# Altium schematic sheet 单片机扩展.SchDoc
size A3
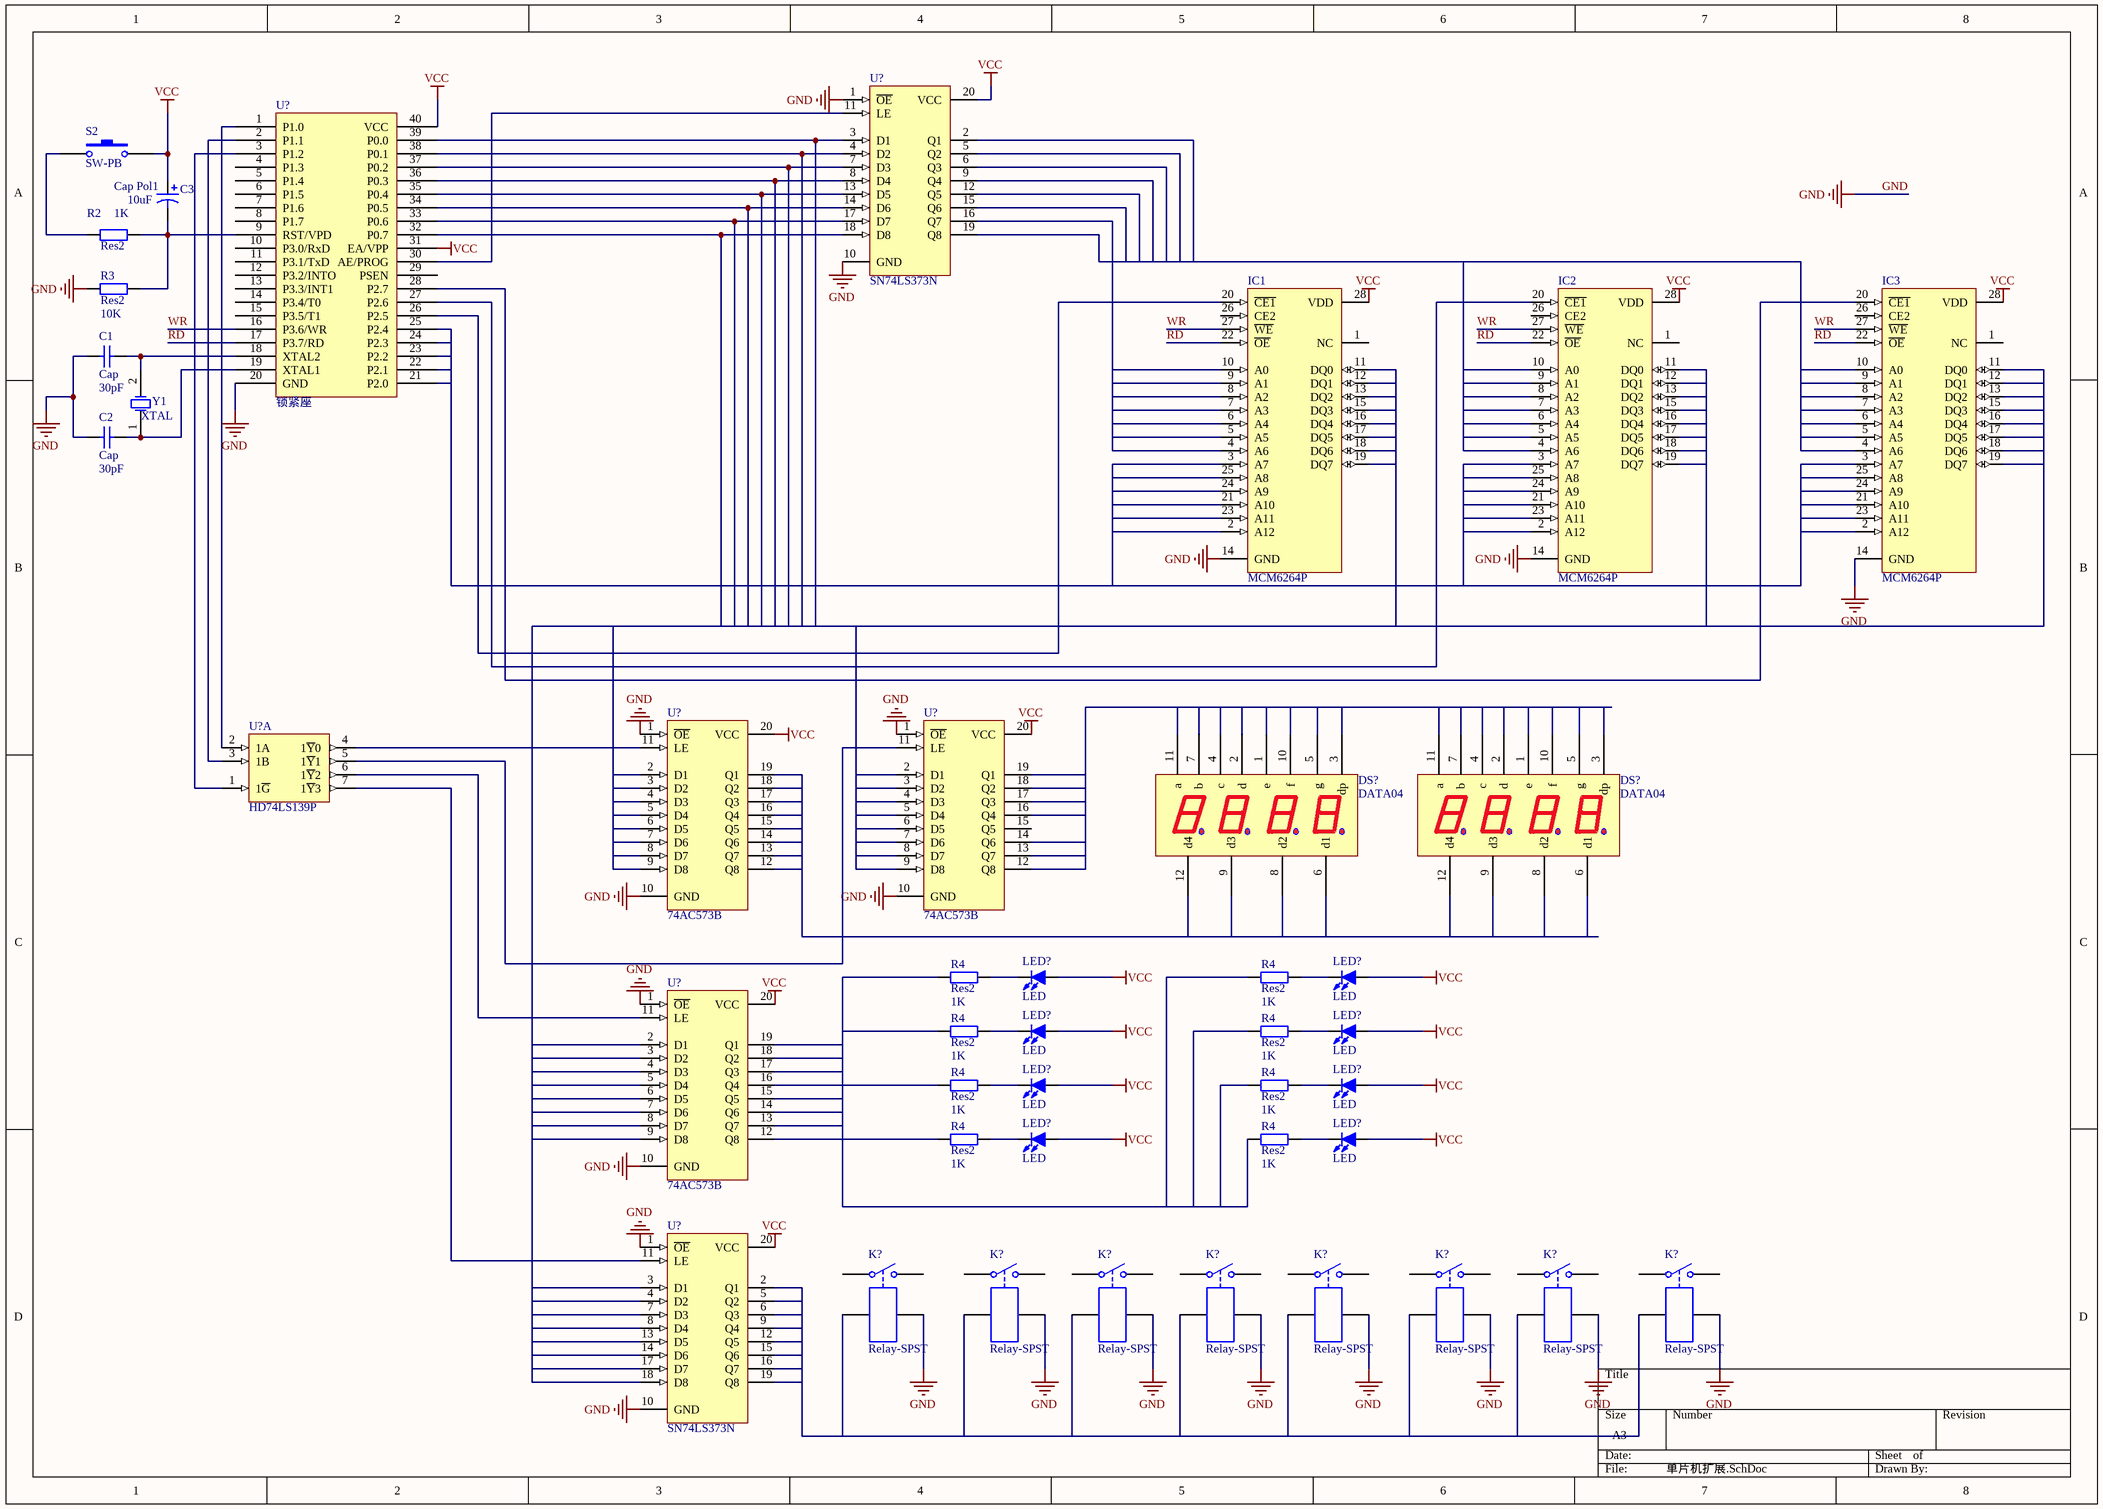
[diagram p0: 单片机扩展.SchDoc]

## Parts
(Parts that share a designator on the sheet are numbered #1, #2 ... from top to bottom, then left to right.)
C1  Cap  value 30pF  [RAD-0.3]
C2  Cap  value 30pF  [RAD-0.3]
C3  Cap Pol1  value 10uF  [RB7.6-15]
DS?#1  DATA04  [DS4]
DS?#2  DATA04  [DS4]
IC1  MCM6264P  [710B-01]
IC2  MCM6264P  [710B-01]
IC3  MCM6264P  [710B-01]
K?#1  Relay-SPST  [MODULE4]
K?#2  Relay-SPST  [MODULE4]
K?#3  Relay-SPST  [MODULE4]
K?#4  Relay-SPST  [MODULE4]
K?#5  Relay-SPST  [MODULE4]
K?#6  Relay-SPST  [MODULE4]
K?#7  Relay-SPST  [MODULE4]
K?#8  Relay-SPST  [MODULE4]
LED?#1  LED  [LED 3MM-R]
LED?#2  LED  [LED 3MM-R]
LED?#3  LED  [LED 3MM-R]
LED?#4  LED  [LED 3MM-R]
LED?#5  LED  [LED 3MM-R]
LED?#6  LED  [LED 3MM-R]
LED?#7  LED  [LED 3MM-R]
LED?#8  LED  [LED 3MM-R]
R2  Res2  value 1K  [AXIAL-0.4]
R3  Res2  value 10K  [AXIAL-0.4]
R4#1  Res2  value 1K  [AXIAL-0.4]
R4#2  Res2  value 1K  [AXIAL-0.4]
R4#3  Res2  value 1K  [AXIAL-0.4]
R4#4  Res2  value 1K  [AXIAL-0.4]
R4#5  Res2  value 1K  [AXIAL-0.4]
R4#6  Res2  value 1K  [AXIAL-0.4]
R4#7  Res2  value 1K  [AXIAL-0.4]
R4#8  Res2  value 1K  [AXIAL-0.4]
S2  SW-PB  [SPST-2]
U?#1  SN74LS373N  [N020]
U?#2  锁紧座  [DIP_TP40-600]
U?#3  74AC573B  [DIP20]
U?#4  74AC573B  [DIP20]
U?#5  HD74LS139P  [PRDP0016AE-B]  (part A of 2)
U?#6  74AC573B  [DIP20]
U?#7  SN74LS373N  [N020]
Y1  XTAL  [R38]

## Nets
GND: C1.1 C2.1 IC1.14(GND) IC2.14(GND) IC3.14(GND) K?#1.4 K?#2.4 K?#3.4 K?#4.4 K?#5.4 K?#6.4 K?#7.4 K?#8.4 R3.2 U?#1.1(~{OE}) U?#1.10(GND) U?#2.20(GND) U?#3.1(~{OE}) U?#3.10(GND) U?#4.1(~{OE}) U?#4.10(GND) U?#6.1(~{OE}) U?#6.10(GND) U?#7.1(~{OE}) U?#7.10(GND)
VCC: C3.1 IC1.28(VDD) IC2.28(VDD) IC3.28(VDD) LED?#1.1(A) LED?#2.1(A) LED?#3.1(A) LED?#4.1(A) LED?#5.1(A) LED?#6.1(A) LED?#7.1(A) LED?#8.1(A) S2.2 U?#1.20(VCC) U?#2.31(EA/VPP) U?#2.40(VCC) U?#3.20(VCC) U?#4.20(VCC) U?#6.20(VCC) U?#7.20(VCC)
RD: IC1.22(~{OE}) IC2.22(~{OE}) IC3.22(~{OE}) U?#2.17(P3.7/RD)
WR: IC1.27(~{WE}) IC2.27(~{WE}) IC3.27(~{WE}) U?#2.16(P3.6/WR)
NetC1_2: C1.2 U?#2.18(XTAL2) Y1.2(OSC2)
NetC2_2: C2.2 U?#2.19(XTAL1) Y1.1(OSC1)
NetC3_2: C3.2 R2.2 R3.1 U?#2.9(RST/VPD)
NetIC1_20: IC1.20(~{CE1}) U?#2.26(P2.5)
NetIC2_20: IC2.20(~{CE1}) U?#2.27(P2.6)
NetIC3_20: IC3.20(~{CE1}) U?#2.28(P2.7)
NetLED?#1_2: LED?#1.2(K) R4#1.2
NetLED?#2_2: LED?#2.2(K) R4#2.2
NetLED?#3_2: LED?#3.2(K) R4#3.2
NetLED?#4_2: LED?#4.2(K) R4#4.2
NetLED?#5_2: LED?#5.2(K) R4#5.2
NetLED?#6_2: LED?#6.2(K) R4#6.2
NetLED?#7_2: LED?#7.2(K) R4#7.2
NetLED?#8_2: LED?#8.2(K) R4#8.2
NetR2_1: R2.1 S2.1
NetR4#5_1: R4#5.1 U?#6.16(Q4)
NetR4#7_1: R4#7.1 U?#6.12(Q8)
NetU?#1_3: U?#1.3(D1) U?#2.39(P0.0)
NetU?#1_4: U?#1.4(D2) U?#2.38(P0.1)
NetU?#1_7: U?#1.7(D3) U?#2.37(P0.2)
NetU?#1_8: U?#1.8(D4) U?#2.36(P0.3)
NetU?#1_11: U?#1.11(LE) U?#2.30(AE/PROG)
NetU?#1_13: U?#1.13(D5) U?#2.35(P0.4)
NetU?#1_14: U?#1.14(D6) U?#2.34(P0.5)
NetU?#1_17: U?#1.17(D7) U?#2.33(P0.6)
NetU?#1_18: U?#1.18(D8) U?#2.32(P0.7)
NetU?#2_1: U?#2.1(P1.0) U?#5.2(1A)
NetU?#2_2: U?#2.2(P1.1) U?#5.3(1B)
NetU?#2_3: U?#2.3(P1.2) U?#5.1(1~{G})
NetU?#3_11: U?#3.11(LE) U?#5.4(1~{Y}0)
NetU?#4_11: U?#4.11(LE) U?#5.5(1~{Y}1)
NetU?#5_6: U?#5.6(1~{Y}2) U?#6.11(LE)
NetU?#5_7: U?#5.7(1~{Y}3) U?#7.11(LE)

Not connected (* = marked no-connect by the designer): DS?#1 1(e) 2(d) 3(dp) 4(c) 5(g) 6(d1) 7(b) 8(d2) 9(d3) 10(f) 11(a) 12(d4); DS?#2 1(e) 2(d) 3(dp) 4(c) 5(g) 6(d1) 7(b) 8(d2) 9(d3) 10(f) 11(a) 12(d4); IC1 1(NC) 2(A12) 3(A7) 4(A6) 5(A5) 6(A4) 7(A3) 8(A2) 9(A1) 10(A0) 11(DQ0) 12(DQ1) 13(DQ2) 15(DQ3) 16(DQ4) 17(DQ5) 18(DQ6) 19(DQ7) 21(A10) 23(A11) 24(A9) 25(A8) 26(CE2); IC2 1(NC) 2(A12) 3(A7) 4(A6) 5(A5) 6(A4) 7(A3) 8(A2) 9(A1) 10(A0) 11(DQ0) 12(DQ1) 13(DQ2) 15(DQ3) 16(DQ4) 17(DQ5) 18(DQ6) 19(DQ7) 21(A10) 23(A11) 24(A9) 25(A8) 26(CE2); IC3 1(NC) 2(A12) 3(A7) 4(A6) 5(A5) 6(A4) 7(A3) 8(A2) 9(A1) 10(A0) 11(DQ0) 12(DQ1) 13(DQ2) 15(DQ3) 16(DQ4) 17(DQ5) 18(DQ6) 19(DQ7) 21(A10) 23(A11) 24(A9) 25(A8) 26(CE2); K?#1 1 2 3; K?#2 1 2 3; K?#3 1 2 3; K?#4 1 2 3; K?#5 1 2 3; K?#6 1 2 3; K?#7 1 2 3; K?#8 1 2 3; R4#1 1; R4#2 1; R4#3 1; R4#4 1; R4#6 1; R4#8 1; U?#1 2(Q1) 5(Q2) 6(Q3) 9(Q4) 12(Q5) 15(Q6) 16(Q7) 19(Q8); U?#2 4(P1.3) 5(P1.4) 6(P1.5) 7(P1.6) 8(P1.7) 10(P3.0/RxD) 11(P3.1/TxD) 12(P3.2/INTO) 13(P3.3/INT1) 14(P3.4/T0) 15(P3.5/T1) 21(P2.0) 22(P2.1) 23(P2.2) 24(P2.3) 25(P2.4) 29(PSEN); U?#3 2(D1) 3(D2) 4(D3) 5(D4) 6(D5) 7(D6) 8(D7) 9(D8) 12(Q8) 13(Q7) 14(Q6) 15(Q5) 16(Q4) 17(Q3) 18(Q2) 19(Q1); U?#4 2(D1) 3(D2) 4(D3) 5(D4) 6(D5) 7(D6) 8(D7) 9(D8) 12(Q8) 13(Q7) 14(Q6) 15(Q5) 16(Q4) 17(Q3) 18(Q2) 19(Q1); U?#5 8(GND) 16(VCC); U?#6 2(D1) 3(D2) 4(D3) 5(D4) 6(D5) 7(D6) 8(D7) 9(D8) 13(Q7) 14(Q6) 15(Q5) 17(Q3) 18(Q2) 19(Q1); U?#7 2(Q1) 3(D1) 4(D2) 5(Q2) 6(Q3) 7(D3) 8(D4) 9(Q4) 12(Q5) 13(D5) 14(D6) 15(Q6) 16(Q7) 17(D7) 18(D8) 19(Q8)

## Library data of the parts
C1 C2 = Cap: Capacitor; Published: 8-Jun-2000; LatestRevisionDate: 17-Jul-2002; LatestRevisionNote: Re-released for DXP Platform.; PackageReference: RAD-0.3; Publisher: Altium Limited; PackageDescription: Radial Cap, Thru-Hole; 2 Leads; 0.3 in Pin Spacing
C3 = Cap Pol1: Polarized Capacitor (Radial); Published: 8-Jun-2000; LatestRevisionDate: 17-Jul-2002; LatestRevisionNote: Re-released for DXP Platform.; PackageReference: RB7.6-15; Publisher: Altium Limited; PackageDescription: Polarized Capacitor (Radial); 2 Leads
DS?#1 DS?#2 = DATA04: DS?
IC1-IC3 = MCM6264P: 8K x 8-Bit Fast Static RAM; Published: 17-Jul-2002; LatestRevisionDate: 06-Jun-2005; LatestRevisionNote: Stylized 3D Model Added.; DatasheetVersion: 1991; PackageReference: 710B-01; Publisher: Altium Limited; PackageDescription: DIP; 28 Leads; Row Spacing 7.62 mm; Pitch 2.54 mm; ComponentLink1Description: Manufacturer Link; ComponentLink1URL: http://www.motorola.com/
K?#1-K?#8 = Relay-SPST: Single-Pole Single-Throw Relay; Published: 24-Mar-1999; LatestRevisionDate: 17-Jul-2002; LatestRevisionNote: Re-released for DXP Platform.; PackageReference: MODULE4; Publisher: Altium Limited
LED?#1-LED?#8 = LED-3MM: 插件LED; 版权归属: 黎明电子style; BOM名称: 插件LED; 学习资源: https://lmdzstyle.taobao.com/
R2 R3 R4#1-R4#8 = Res2: Resistor; Published: 8-Jun-2000; LatestRevisionDate: 17-Jul-2002; LatestRevisionNote: Re-released for DXP Platform.; PackageReference: AXIAL-0.4; Publisher: Altium Limited; PackageDescription: Axial Device, Thru-Hole; 2 Leads; 0.4 in Pin Spacing
S2 = SW-PB: Switch; Published: 24-Mar-1999; LatestRevisionDate: 17-Jul-2002; LatestRevisionNote: Re-released for DXP Platform.; PackageReference: SPST-2; Publisher: Altium Limited; PackageDescription: Switch; 2 Leads
U?#1 U?#7 = SN74LS373N: Octal D-Type Transparent Latche and Edge-Triggered Flip-Flops; Published: 8-Jun-2000; LatestRevisionDate: 04-Mar-2005; LatestRevisionNote: Stylized 3D Model Added.; DatasheetVersion: Mar-1988; PackageVersion: Oct-1995; PackageReference: N020; Publisher: Altium Limited; PackageDescription: DIP; 20 Leads; Row Spacing 7.62 mm; Pitch 2.54 mm; ComponentLink1Description: Manufacturer Link; ComponentLink1URL: http://www.ti.com/; ComponentLink2Description: Datasheet; ComponentLink2URL: http://www-s.ti.com/sc/ds/sn74s373.pdf
U?#2 = STC89C52
U?#3 U?#4 U?#6 = 74AC573B: Octal D-Type Latch with 3-State Output Non-Inverting; Published: 8-Jun-2000; LatestRevisionDate: 06-Jun-2005; LatestRevisionNote: Stylized 3D Model Added.; DatasheetVersion: Apr-1997; PackageVersion: Jun-1998; PackageReference: DIP20; Publisher: Altium Limited; PackageDescription: DIP; 20 Leads; Row Spacing 7.62 mm; Pitch 2.54 mm; Code_JEDEC: MS-015-AE; ComponentLink1Description: Manufacturer Link; ComponentLink1URL: http://www.st.com/; ComponentLink2Description: Datasheet; ComponentLink2URL: http://www.st.com/stonline/products/literature/ds/4702/74ac573.pdf
U?#5 = HD74LS139P: Dual 2-Line-to-4-Line Decoders / Demultiplexers; Published: 10-Feb-2010; DatasheetVersion: Rev.2.00, Feb-2005; PackageVersion: Sep-2005; PackageReference: PRDP0016AE-B; Publisher: Altium Limited; PackageDescription: DIP, Plastic, 16-Pin, Row Spacing 7.62 mm, Pitch 2.54 mm; Code_JEITA: P-DIP16-6.3x19.2-2.54; ComponentLink1Description: Manufacturer Link; ComponentLink1URL: http://sg.renesas.com/fmwk.jsp?cnt=hd74ls_root.jsp&fp=/products/standard_ic/general_purpose_logic/5v_standard_logic/hd74ls/; ComponentLink2Description: Datasheet; ComponentLink2URL: http://documentation.renesas.com/eng/products/logic/rej03d0435_hd74ls139.pdf; ComponentLink3Description: Packaging Specification; ComponentLink3URL: http://sg.renesas.com/media/products/common_info/package/pdf/ic/code/prdp0016ae_b.pdf
Y1 = XTAL: Crystal Oscillator; Published: 8-Jun-2000; LatestRevisionDate: 17-Jul-2002; LatestRevisionNote: Re-released for DXP Platform.; PackageReference: R38; Publisher: Altium Limited; PackageDescription: Crystal, Thru-Hole; 2 Leads; Body 3.1 x 8.2 mm (Dia.xH)